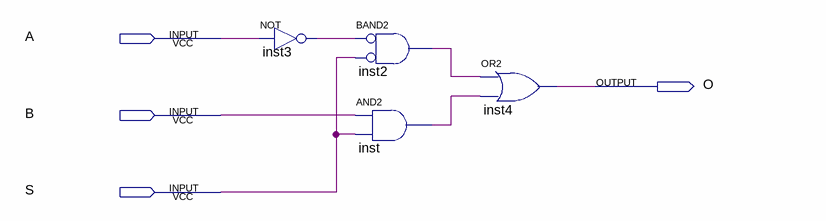
[diagram p0: schematic sheet]
// Quartus schematic mux21.bdf as structural Verilog: 4 symbols, 4 pins
module mux21 (
  input  A,
  input  B,
  input  S,
  output O
);

  wire inst2_out, inst3_out, inst_out;

  not inst3 (inst3_out, A);
  and inst2 (inst2_out, ~inst3_out, ~S);  // BAND2
  and inst (inst_out, B, S);
  or inst4 (O, inst2_out, inst_out);
endmodule
